# Altium schematic sheet Top.SchDoc
size B; Author: E. Sims; Organization: Let's Build Rockets Inc.; SheetNumber: 1; SheetTotal: 1
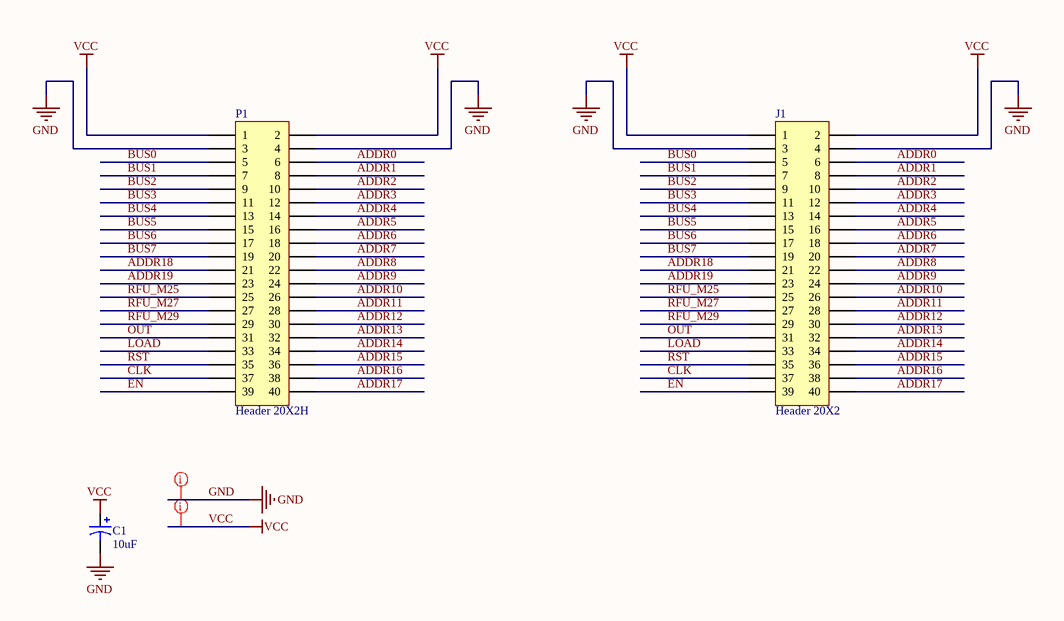
[diagram p0: Top.SchDoc]

## Parts
C1  value 10uF  [C5x7]  (hidden comment: Cap Pol5)
J1  Header 20X2  [HDR2X20]
P1  Header 20X2H  [HDR2X20H]

## Nets
GND: C1.2 J1.3 J1.4 P1.3 P1.4
VCC: C1.1 J1.1 J1.2 P1.1 P1.2
ADDR0: J1.6 P1.6
ADDR1: J1.8 P1.8
ADDR2: J1.10 P1.10
ADDR3: J1.12 P1.12
ADDR4: J1.14 P1.14
ADDR5: J1.16 P1.16
ADDR6: J1.18 P1.18
ADDR7: J1.20 P1.20
ADDR8: J1.22 P1.22
ADDR9: J1.24 P1.24
ADDR10: J1.26 P1.26
ADDR11: J1.28 P1.28
ADDR12: J1.30 P1.30
ADDR13: J1.32 P1.32
ADDR14: J1.34 P1.34
ADDR15: J1.36 P1.36
ADDR16: J1.38 P1.38
ADDR17: J1.40 P1.40
ADDR18: J1.21 P1.21
ADDR19: J1.23 P1.23
BUS0: J1.5 P1.5
BUS1: J1.7 P1.7
BUS2: J1.9 P1.9
BUS3: J1.11 P1.11
BUS4: J1.13 P1.13
BUS5: J1.15 P1.15
BUS6: J1.17 P1.17
BUS7: J1.19 P1.19
CLK: J1.37 P1.37
EN: J1.39 P1.39
LOAD: J1.33 P1.33
~{OUT}: J1.31 P1.31
RFU_M25: J1.25 P1.25
RFU_M27: J1.27 P1.27
RFU_M29: J1.29 P1.29
RST: J1.35 P1.35

## Layout directives
rule Width Constraint [Pref Width = 20mil    Min Width = 20mil    Max Width = 50mil]; rule Routing Via Style [Pref Size = 35mil    Pref Hole Size = 20mil]; net class PWR: GND, VCC

## Notes on the sheet
- Let's Build Rocket's Inc. Modular Paylaod System Based on TMP-010 Rev
  For more information visit https://github.com/LetsBuildRockets/Modular-Payload-System
  This work is licensed under CC BY-NC 4.0. To view a copy of this license, visit https://creativecommons.org/licenses/by-nc/4.0
- Title
- Size:
- Date:
- Assembly Variant:
- B
- Number:
- Time:
- Revision:
- Sheet
- of
- Author:
- File:

## Library data of the parts
C1 = Cap Pol5: Polarized Capacitor; Published: 8-Jun-2000; LatestRevisionDate: 17-Jul-2002; LatestRevisionNote: Re-released for DXP Platform.; PackageReference: POLAR0.8; Publisher: Altium Limited; PackageDescription: Polarized Capacitor; 2 Leads
J1 = Header 20X2: Header, 20-Pin, Dual row; LatestRevisionDate: 17-Jul-2002; LatestRevisionNote: Re-released for DXP Platform.; Publisher: Altium Limited
P1 = Header 20X2H: Header, 20-Pin, Dual row, Right Angle; System: Connector; LatestRevisionDate: 17-Jul-2002; LatestRevisionNote: Re-released for DXP Platform.; Publisher: Altium Limited